# EAGLE design AlarmClock (EAGLE 7.6.0)
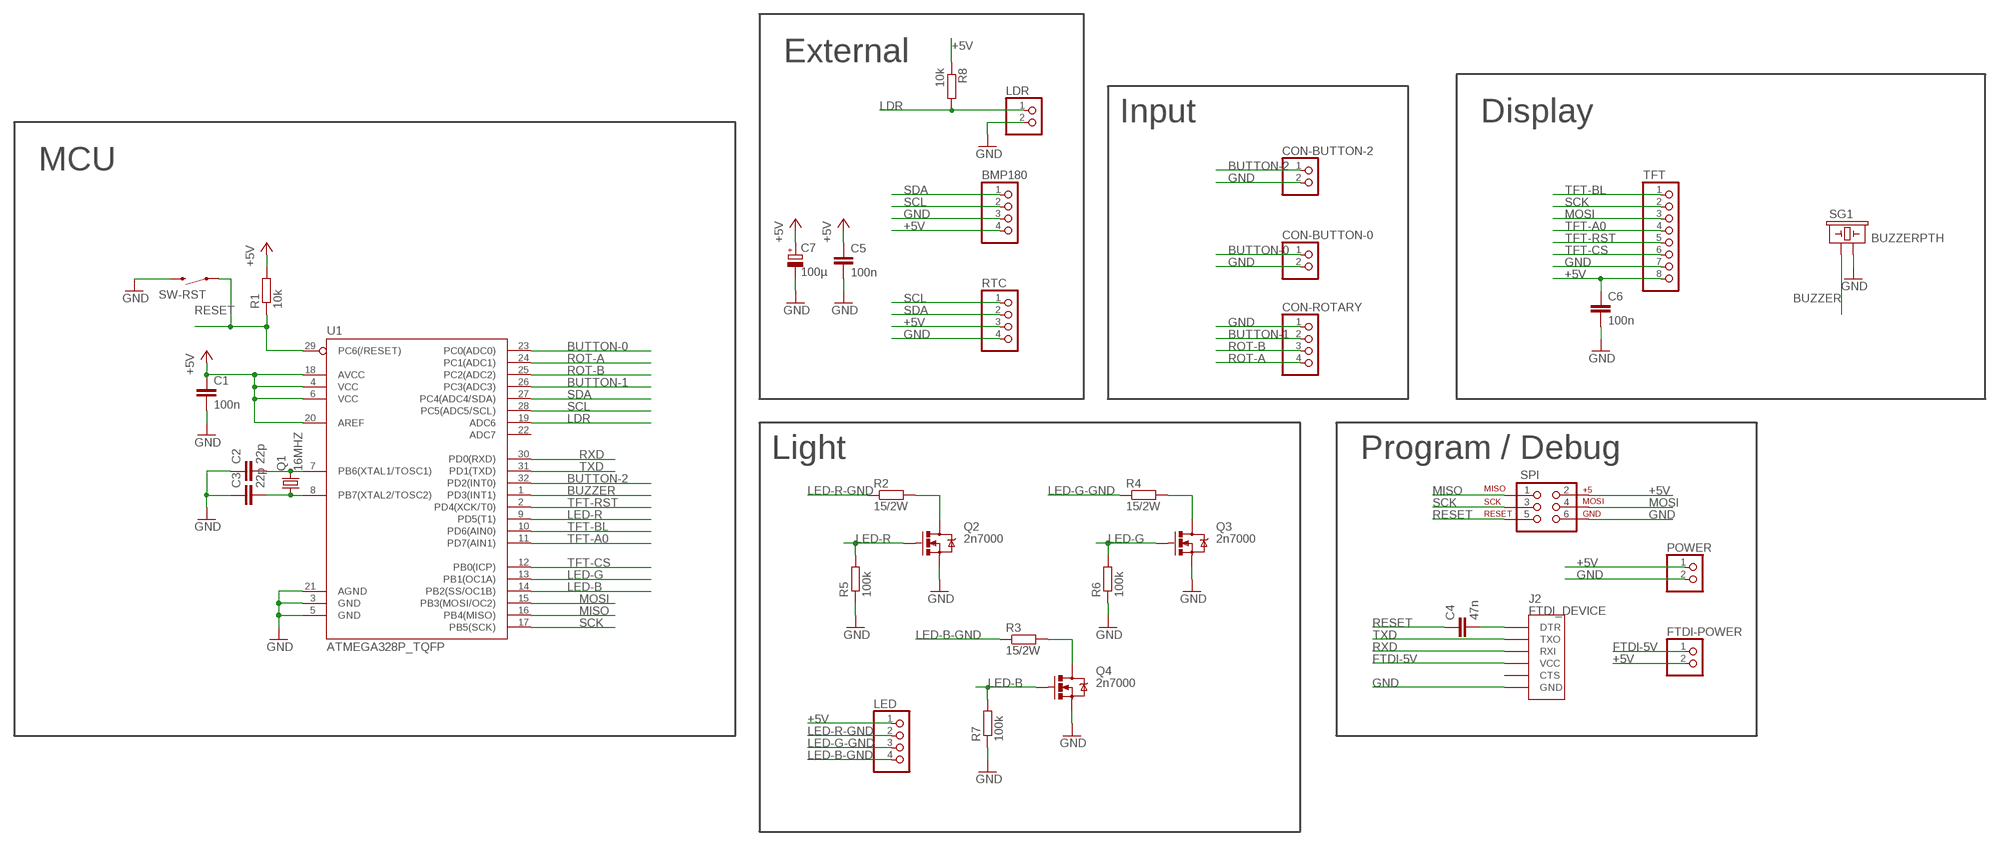
[diagram p0: schematic, sheet 1]

## Parts
BMP180  PINHD-1X4  [1X04]
C1  100n  C-EUC0805  [C0805]
C2  22p  C-EUC0805  [C0805]
C3  22p  C-EUC0805  [C0805]
C4  47n  C-EUC0805  [C0805]
C5  100n  C-EUC0805  [C0805]
C6  100n  C-EUC0805  [C0805]
C7  100µ  CPOL-EUF  [PANASONIC_F]
CON-BUTTON-0  PINHD-1X2/90  [1X02/90]
CON-BUTTON-2  PINHD-1X2/90  [1X02/90]
CON-ROTARY  PINHD-1X4/90  [1X04/90]
FTDI-POWER  PINHD-1X2  [1X02]
J2  FTDI_DEVICE  [FTDI_DEVICE_SIDE]
LDR  PINHD-1X2  [1X02]
LED  PINHD-1X4  [1X04]
POWER  PINHD-1X2  [1X02]
Q1  16MHZ  CRYSTALHC49UP  [HC49UP]
Q2  2n7000  MOSFET-NCHANNEL2N7000  [TO-92]
Q3  2n7000  MOSFET-NCHANNEL2N7000  [TO-92]
Q4  2n7000  MOSFET-NCHANNEL2N7000  [TO-92]
R1  10k  R-EU_M0805  [M0805]
R2  15/2W  R-EU_0414/15  [0414/15]
R3  15/2W  R-EU_0414/15  [0414/15]
R4  15/2W  R-EU_0414/15  [0414/15]
R5  100k  R-EU_M0805  [M0805]
R6  100k  R-EU_M0805  [M0805]
R7  100k  R-EU_M0805  [M0805]
R8  10k  R-EU_R0805  [R0805]
RTC  PINHD-1X4  [1X04]
SG1  BUZZERPTH  [BUZZER-12MM]
SPI  AVR_SPI_PRG_6NS  [2X3-NS]
SW-RST  SWITCH-MOMENTARY-2SMD-1101NE  [TACTILE-SWITCH-1101NE]
TFT  PINHD-1X8  [1X08]
U1  ATMEGA328P_TQFP  [TQFP32-08]

## Nets
+5V: BMP180.4 C1.1 C5.1 C6.1 C7.+ FTDI-POWER.2 LED.1 POWER.1 R1.2 R8.1 RTC.3 SPI.2 TFT.8 U1.4(VCC) U1.6(VCC) U1.18(AVCC) U1.20(AREF)
BUTTON-0: CON-BUTTON-0.1 U1.23(PC0(ADC0))
BUTTON-1: CON-ROTARY.2 U1.26(PC3(ADC3))
BUTTON-2: CON-BUTTON-2.1 U1.32(PD2(INT0))
BUZZER: SG1.+ U1.1(PD3(INT1))
FTDI-5V: FTDI-POWER.1 J2.P$4(VCC)
GND: BMP180.3 C1.2 C2.1 C3.1 C5.2 C6.2 C7.- CON-BUTTON-0.2 CON-BUTTON-2.2 CON-ROTARY.1 J2.P$6(GND) LDR.2 POWER.2 Q2.1(S) Q3.1(S) Q4.1(S) R5.1 R6.1 R7.1 RTC.4 SG1.- SPI.6 SW-RST.2 TFT.7 U1.3(GND) U1.5(GND) U1.21(AGND)
LDR: LDR.1 R8.2 U1.19(ADC6)
LED-B: Q4.2(G) R7.2 U1.14(PB2(SS/OC1B))
LED-B-GND: LED.4 R3.1
LED-G: Q3.2(G) R6.2 U1.13(PB1(OC1A))
LED-G-GND: LED.3 R4.1
LED-R: Q2.2(G) R5.2 U1.9(PD5(T1))
LED-R-GND: LED.2 R2.1
MISO: SPI.1 U1.16(PB4(MISO))
MOSI: SPI.4 TFT.3 U1.15(PB3(MOSI/OC2))
N$1: C4.2 J2.P$1(DTR)
N$2: C2.2 Q1.2 U1.7(PB6(XTAL1/TOSC1))
N$3: C3.2 Q1.1 U1.8(PB7(XTAL2/TOSC2))
N$4: Q2.3(D) R2.2
N$5: Q3.3(D) R4.2
N$6: Q4.3(D) R3.2
RESET: C4.1 R1.1 SPI.5 SW-RST.1 U1.29(PC6(/RESET))
ROT-A: CON-ROTARY.4 U1.24(PC1(ADC1))
ROT-B: CON-ROTARY.3 U1.25(PC2(ADC2))
RXD: J2.P$3(RXI) U1.30(PD0(RXD))
SCK: SPI.3 TFT.2 U1.17(PB5(SCK))
SCL: BMP180.2 RTC.1 U1.28(PC5(ADC5/SCL))
SDA: BMP180.1 RTC.2 U1.27(PC4(ADC4/SDA))
TFT-A0: TFT.4 U1.11(PD7(AIN1))
TFT-BL: TFT.1 U1.10(PD6(AIN0))
TFT-CS: TFT.6 U1.12(PB0(ICP))
TFT-RST: TFT.5 U1.2(PD4(XCK/T0))
TXD: J2.P$2(TXO) U1.31(PD1(TXD))
Unconnected: J2.P$5(CTS) U1.22(ADC7)

## Notes on the sheet
- External
- Input | Display
- MCU
- Light | Program / Debug

## Library data of the parts
BMP180 CON-ROTARY LED RTC = pinhead:PINHD-1X4: PIN HEADER
C1-C6 = resistor:C-EU: CAPACITOR, European symbol
C7 = resistor:CPOL-EU: POLARIZED CAPACITOR, European symbol
CON-BUTTON-0 CON-BUTTON-2 FTDI-POWER LDR POWER = pinhead:PINHD-1X2: PIN HEADER
J2 = SparkFun-Connectors:FTDI_DEVICE: Connector which mates to FTDI basic or FTDI cable.
Q1 = crystal:CRYSTAL: CRYSTAL; OC_FARNELL: unknown; OC_NEWARK: unknown
Q2-Q4 = SparkFun-DiscreteSemi:MOSFET-NCHANNEL: Common NMOSFET Parts MFG P/N Store ID Prod ID FDD8780 TRANS-09984 SI7820DN TRANS-11055 FDS6630A IC-08089 2N7002PW TRANS-11151 FQP30N06L COM-10213 TRANS-10060 BSS123LT1G TRANS-08345 BSS138 TRANS-00830 BS170 2N7000
R1-R8 = resistor:R-EU_: RESISTOR, European symbol
SG1 = SparkFun-Electromechanical:BUZZER: Buzzer 12mm Spark Fun Electronics SKU : Comp-Buzzer
SPI = SparkFun-Connectors:AVR_SPI_PRG_6: AVR ISP 6 Pin This is the reduced ISP connector for AVR programming. Common on Arduino. This footprint will take up less PCB space and can be used with a 10-pin to 6-pin adapter such as SKU: BOB-08508 **Special note about "TEST_POINT" package. The stop mask is on the top side, so if you want your programming test points to be on the bottom of your board, make sure to place this package on the bottom side of the board. This also ensure that the orientation to program from the bottom side will be correct.
SW-RST = SparkFun-Electromechanical:SWITCH-MOMENTARY-2: Various NO switches- pushbuttons, reed, etc; PROD_ID: SWCH-00815
TFT = pinhead:PINHD-1X8: PIN HEADER
U1 = SparkFun-DigitalIC:ATMEGA328P_TQFP; PROD_ID: IC-09069

## Board
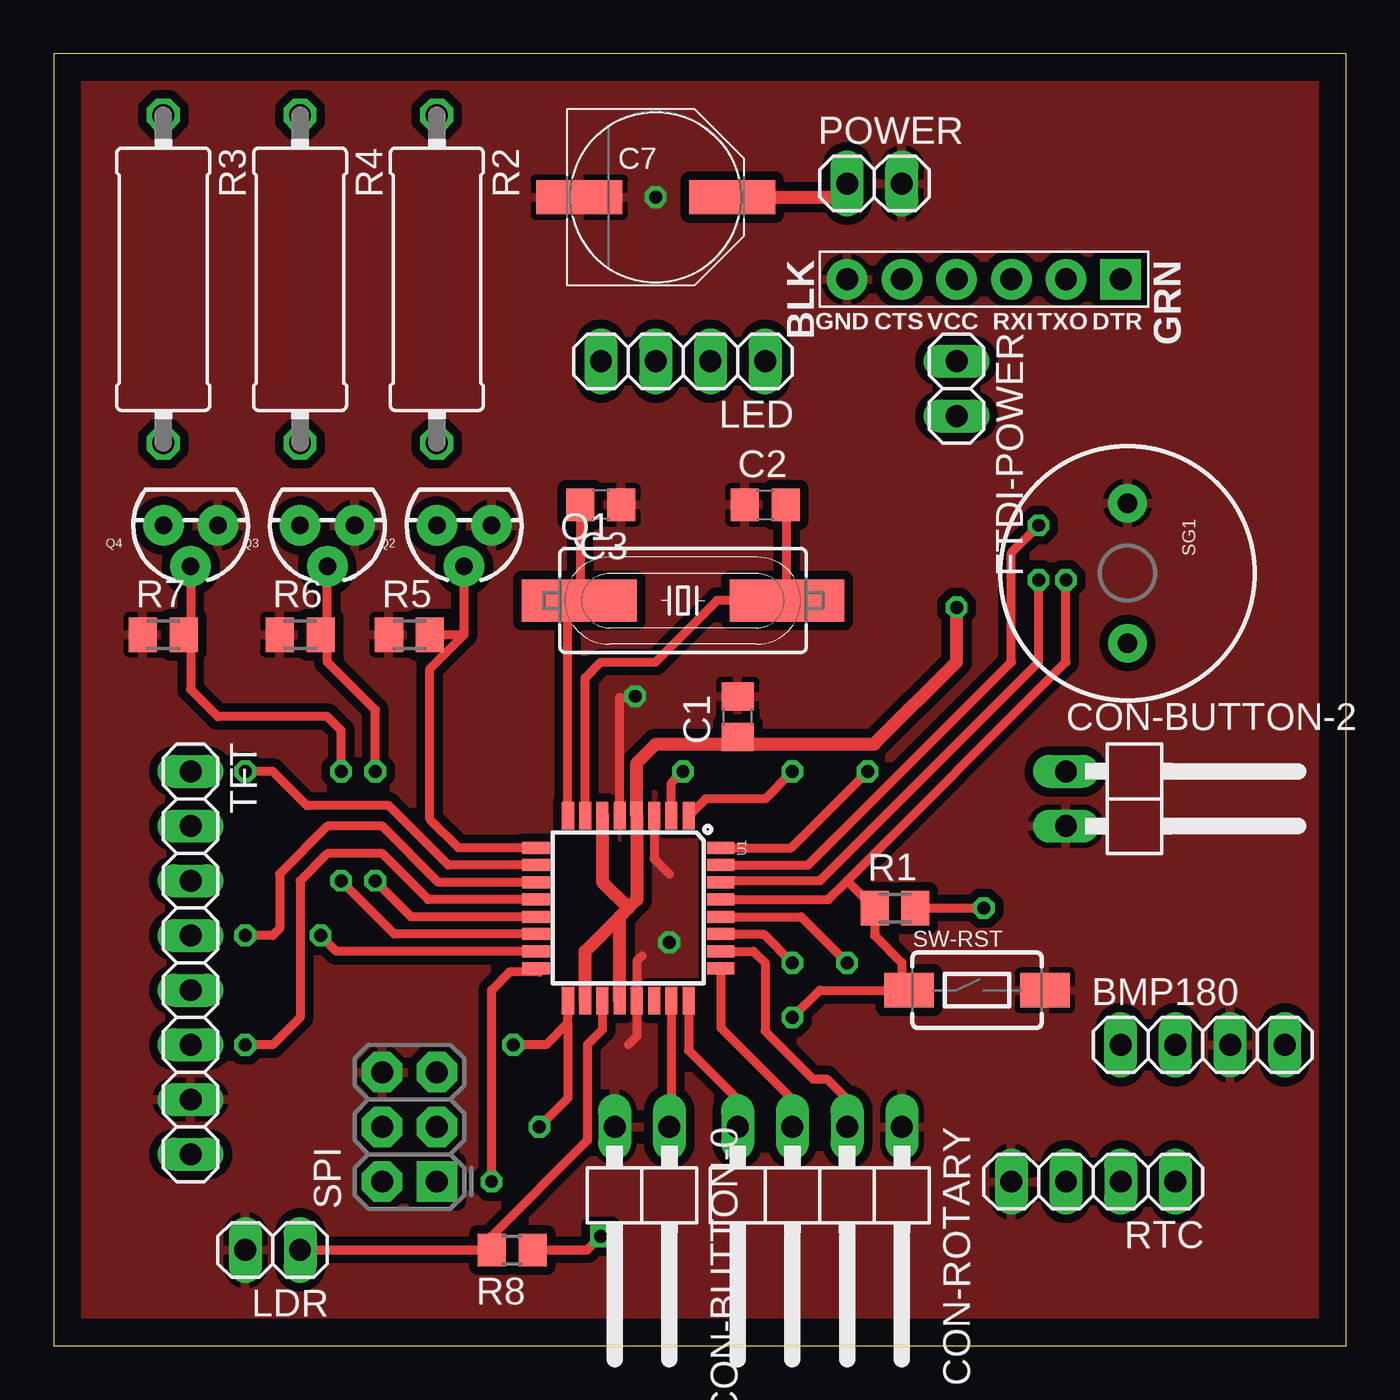
[diagram p1: board, top side]
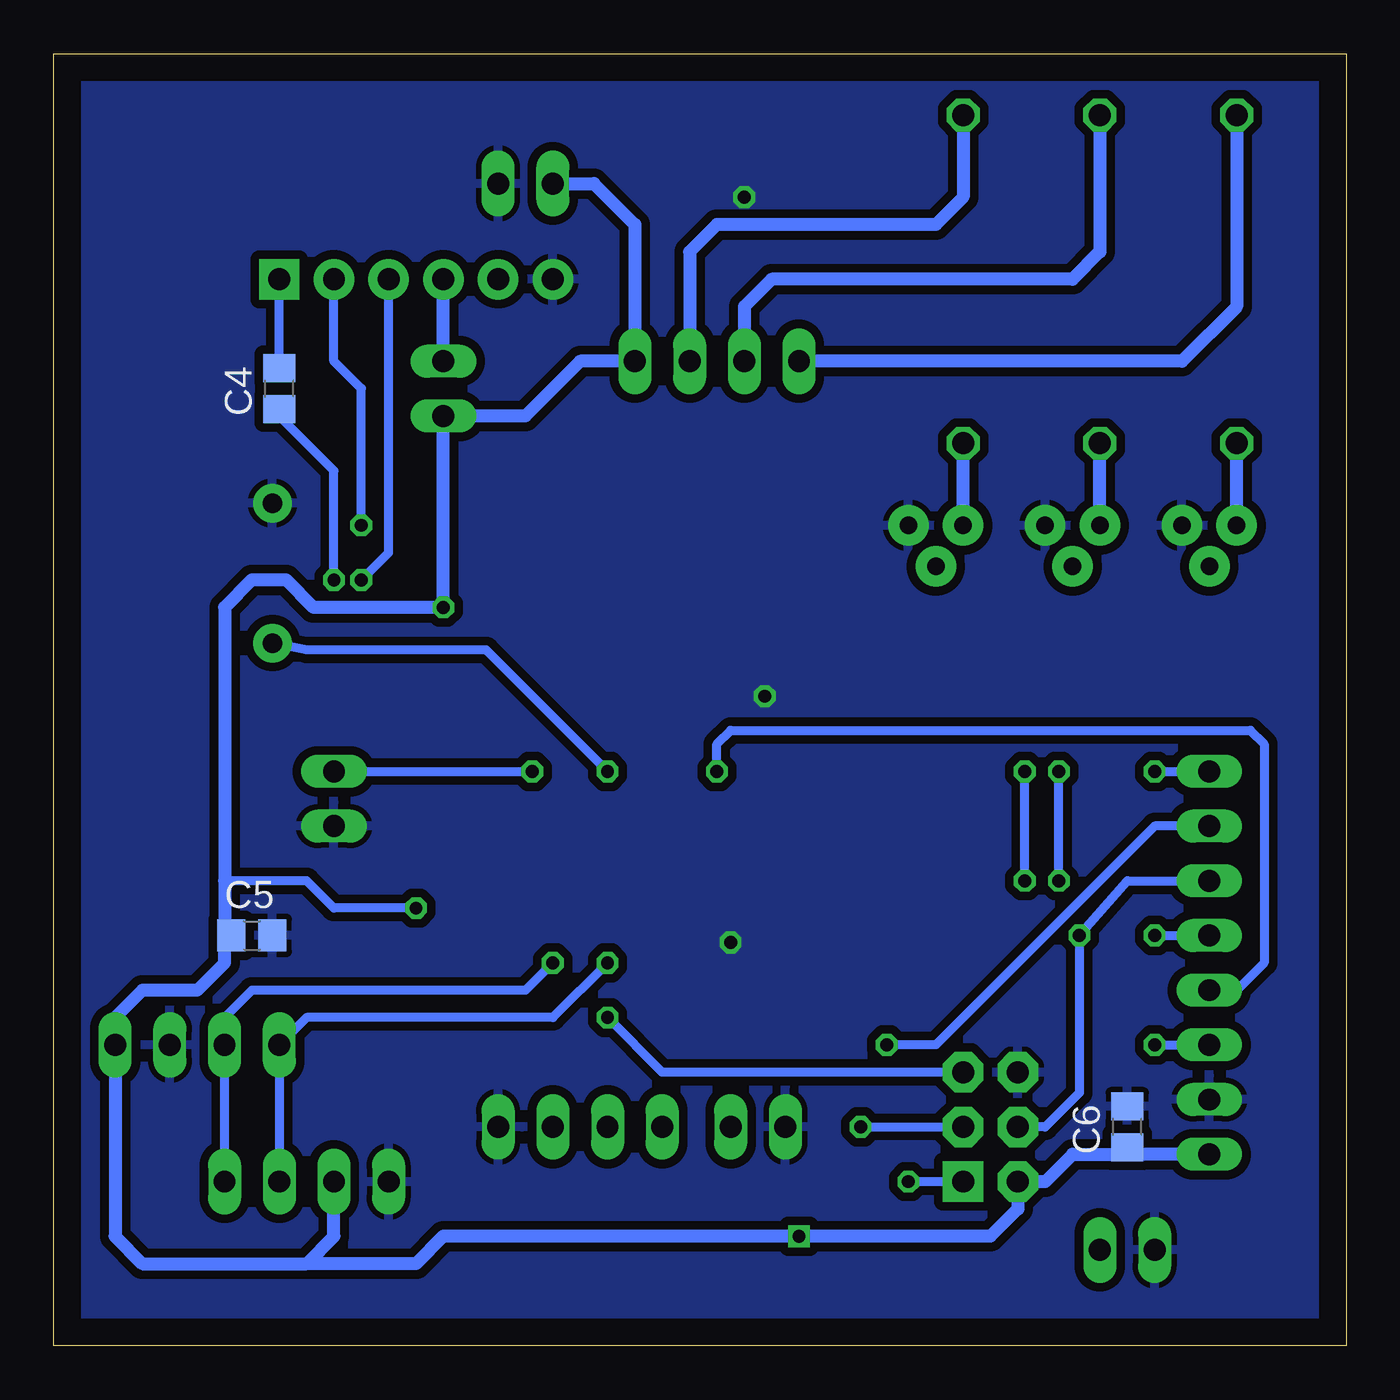
[diagram p2: board, bottom side, seen from below]

Size 59.99 x 60 mm. Coordinates in mm from the lower left corner, seen from the top.
Outline: 0,0 59.99,0 59.99,60 0,60 0,0
Copper layers (1*16): Top 0.035mm / dielectric 1.5mm / Bottom 0.035mm
Design rules "default *": minimum track width 10mil, minimum drill 0.6mm, track to track 8mil, track to pad 8mil, pad to pad 8mil, via to via 8mil, smd to smd 8mil, copper to edge 50mil, drill to drill 8mil, minimum pad ring 10mil, minimum via ring 8mil, stop-mask expansion 4mil, vias tented up to drill 0mil, thermal gap 10mil

### Footprints (pad centres in the part's own frame; a part is rotated, then mirrored left to right if it is on the bottom)
1X04 = drill 1.016 long: 1 -3.81,0; 2 -1.27,0; 3 1.27,0; 4 3.81,0
C0805 = smd 1.3 x 1.5: 1 -0.95,0; 2 0.95,0
PANASONIC_F = smd 4 x 1.6: + 3.55,0; - -3.55,0
1X02/90 = drill 1.016 long: 1 -1.27,-3.81; 2 1.27,-3.81
1X04/90 = drill 1.016 long: 1 -3.81,-3.81; 2 -1.27,-3.81; 3 1.27,-3.81; 4 3.81,-3.81
1X02 = drill 1.016 long: 1 -1.27,0; 2 1.27,0
FTDI_DEVICE_SIDE = drill 1.016 pad 1.88 square: P$1 -6.35,0 | drill 1.016 pad 1.88: P$2 -3.81,0; P$3 -1.27,0; P$4 1.27,0; P$5 3.81,0; P$6 6.35,0
HC49UP = smd 5.334 x 1.93: 1 -4.826,0; 2 4.826,0
TO-92 = drill 0.813 pad 1.88: 1 -1.27,0; 2 0,1.905; 3 1.27,0
M0805 = smd 1.3 x 1.6: 1 -0.95,0; 2 0.95,0
0414/15 = drill 1.016 octagon: 1 -7.62,0; 2 7.62,0
R0805 = smd 1.3 x 1.5: 1 -0.95,0; 2 0.95,0
BUZZER-12MM = drill 0.9 pad 1.778: + 3.25,0; - -3.25,0
2X3-NS = drill 1.016 pad 1.88 square: 1 -2.54,-1.27 | drill 1.016 pad 1.88 octagon: 2 -2.54,1.27; 3 0,-1.27; 4 0,1.27; 5 2.54,-1.27; 6 2.54,1.27
TACTILE-SWITCH-1101NE = smd 2.3 x 1.6: 1 -3.15,0; 2 3.15,0
1X08 = drill 1.016 long: 1 -8.89,0; 2 -6.35,0; 3 -3.81,0; 4 -1.27,0; 5 1.27,0; 6 3.81,0; 7 6.35,0; 8 8.89,0
TQFP32-08 = smd 1.27 x 0.559: 1 -4.293,2.8; 2 -4.293,2; 3 -4.293,1.2; 4 -4.293,0.4; 5 -4.293,-0.4; 6 -4.293,-1.2; 7 -4.293,-2; 8 -4.293,-2.8; 17 4.293,-2.8; 18 4.293,-2; 19 4.293,-1.2; 20 4.293,-0.4; 21 4.293,0.4; 22 4.293,1.2; 23 4.293,2; 24 4.293,2.8 | smd 0.559 x 1.27: 9 -2.8,-4.293; 10 -2,-4.293; 11 -1.2,-4.293; 12 -0.4,-4.293; 13 0.4,-4.293; 14 1.2,-4.293; 15 2,-4.293; 16 2.8,-4.293; 25 2.8,4.293; 26 2,4.293; 27 1.2,4.293; 28 0.4,4.293; 29 -0.4,4.293; 30 -1.2,4.293; 31 -2,4.293; 32 -2.8,4.293

### Placement (x,y rotation side)
BMP180  53.34,13.97 0 top
C1  31.75,29.21 90 top
C2  33.02,39.05 0 top
C3  25.4,39.05 180 top
C4  49.53,44.45 90 bottom
C5  50.8,19.05 0 bottom
C6  10.16,10.16 90 bottom
C7  27.94,53.34 0 top
CON-BUTTON-0  27.3,6.35 180 top
CON-BUTTON-2  50.8,25.4 270 top
CON-ROTARY  35.56,6.35 180 top
FTDI-POWER  41.91,44.45 270 top
J2  43.18,49.53 180 top
LDR  10.16,4.45 180 top
LED  29.21,45.72 180 top
POWER  38.1,53.98 0 top
Q1  29.21,34.61 0 top
Q2  19.05,38.1 180 top
Q3  12.7,38.1 180 top
Q4  6.35,38.1 180 top
R1  39.05,20.32 0 top
R2  17.78,49.53 270 top
R3  5.08,49.53 270 top
R4  11.43,49.53 270 top
R5  16.51,33.02 0 top
R6  11.43,33.02 0 top
R7  5.08,33.02 0 top
R8  21.27,4.45 180 top
RTC  48.26,7.62 180 top
SG1  49.85,35.88 270 top
SPI  16.51,10.16 90 top
SW-RST  42.86,16.51 0 top
TFT  6.35,17.78 270 top
U1  26.67,20.32 270 top

### Tracks (layer width: path | path; a pad name or v marks a point on that pad's centre or on a via)
+5V  (via drill 0.6)
  Top 0.406: R1.2 v43.18,20.32 | R8.1 24.77,4.45 v25.4,5.08
  Top 0.61: U1.20 26.27,19.92 | 26.67,20.32 27.07,20.72 U1.4 27.07,27.07 27.94,27.94 31.43,27.94 C1.1 32.07,27.94 38.1,27.94 41.91,31.75 v41.91,34.29 | 26.67,20.32 26.27,19.92 | U1.18 24.67,18.32 26.27,19.92 | U1.6 25.47,21.52 26.67,20.32 | C7.+ 36.2,53.34 POWER.1
  Bottom 0.406: v43.18,20.32 46.99,20.32 48.26,21.59 52.07,21.59
  Bottom 0.61: 52.07,18.73 52.07,21.59 52.07,34.29 50.8,35.56 49.21,35.56 47.94,34.29 v41.91,34.29 FTDI-POWER.2 38.1,43.18 35.56,45.72 LED.1 33.02,52.07 34.92,53.98 POWER.1 | 48.26,3.81 55.88,3.81 57.15,5.08 BMP180.4 57.15,15.24 55.88,16.51 53.34,16.51 52.07,17.78 52.07,18.73 | 48.26,3.81 46.99,5.08 RTC.3 | 52.07,18.73 C5.1 | 10.48,8.89 12.7,8.89 13.97,7.62 SPI.2 15.24,6.35 16.51,5.08 v25.4,5.08 41.91,5.08 43.18,3.81 48.26,3.81 | 10.48,8.89 C6.1 9.84,8.89 TFT.8 10.48,8.89
BUTTON-0
  Top 0.406: U1.23 28.67,10.26 CON-BUTTON-0.1
BUTTON-1
  Top 0.406: U1.26 32.48,18.32 33.02,17.78 33.02,14.61 35.24,12.38 35.88,12.38 36.83,11.43 CON-ROTARY.2
BUTTON-2  (via drill 0.6)
  Top 0.406: v37.78,26.67 34.23,23.12 U1.32
  Bottom 0.406: CON-BUTTON-2.1 v37.78,26.67
BUZZER  (via drill 0.6)
  Top 0.406: v34.29,26.67 33.02,25.4 30.26,25.4 U1.1
  Bottom 0.406: v34.29,26.67 39.93,32.31 48.26,32.31 SG1.+
FTDI-5V
  Bottom 0.61: FTDI-POWER.1 J2.P$4
GND  (via drill 0.6)
  Top 0.406: 27.3,18.1 27.07,17.86 U1.21 27.07,14.37 26.67,13.97 | 26.27,25.8 U1.5 26.27,30.08 v26.99,30.16 | U1.3 27.87,22.61 28.57,21.91
  other vias: 28.57,18.73 27.94,53.34
  pour Bottom (isolate 0.406): 59.69,59.69 0,59.69 0,0 59.69,0
  pour Top (isolate 0.406): 59.69,59.69 0,59.69 0,0 59.69,0
LDR
  Top 0.406: U1.19 25.47,14.68 24.77,13.97 24.77,9.53 20.32,5.08 20.32,4.76 R8.2 LDR.1
LED-B  (via drill 0.6)
  Top 0.406: U1.14 15.8,19.12 v13.34,21.59 | Q4.2 6.35,33.02 | 6.35,33.02 6.35,30.48 7.62,29.21 12.7,29.21 13.34,28.57 v13.34,26.67 | R7.2 6.35,33.02
  Bottom 0.406: v13.34,21.59 v13.34,26.67
LED-B-GND
  Bottom 0.61: R3.1 5.08,48.26 7.62,45.72 LED.4
LED-G  (via drill 0.6)
  Top 0.406: U1.13 16.59,19.92 v14.92,21.59 | v14.92,26.67 14.92,29.53 12.7,31.75 12.7,33.02 | 12.7,33.02 Q3.2 | R6.2 12.7,33.02
  Bottom 0.406: v14.92,21.59 v14.92,26.67
LED-G-GND
  Bottom 0.61: R4.1 11.43,50.8 12.7,49.53 26.67,49.53 27.94,48.26 LED.3
LED-R
  Top 0.406: U1.9 18.79,23.12 17.46,24.45 17.46,31.43 19.05,33.02 | 19.05,33.02 Q2.2 | R5.2 19.05,33.02
LED-R-GND
  Bottom 0.61: R2.1 17.78,53.34 19.05,52.07 29.21,52.07 30.48,50.8 LED.2
MISO  (via drill 0.6)
  Top 0.406: U1.16 22.54,17.36 21.16,17.36 20.32,16.51 v20.32,7.62
  Bottom 0.406: SPI.1 v20.32,7.62
MOSI  (via drill 0.6)
  Top 0.406: U1.15 13.11,18.32 v12.38,19.05
  Bottom 0.406: TFT.3 10.16,21.59 v12.38,19.05 12.38,11.75 13.97,10.16 SPI.4
N$1
  Bottom 0.406: C4.2 J2.P$1
N$2
  Top 0.406: U1.7 24.67,31.02 25.4,31.75 27.94,31.75 30.8,34.61 Q1.2 34.04,38.99 C2.2
N$3
  Top 0.406: C3.2 24.45,34.67 Q1.1 23.87,34.09 U1.8
N$4
  Bottom 0.61: Q2.3 R2.2
N$5
  Bottom 0.61: Q3.3 R4.2
N$6
  Bottom 0.61: Q4.3 R3.2
RESET  (via drill 0.6)
  Top 0.406: 39.69,16.53 SW-RST.1 | v34.29,15.24 35.56,16.51 SW-RST.1 | SW-RST.1 39.37,16.85 39.37,17.78 38.1,19.05 R1.1 36.83,21.59 | U1.29 35.96,20.72 36.83,21.59 | 36.83,21.59 46.99,31.75 v46.99,35.56
  Bottom 0.406: SPI.5 31.75,12.7 v34.29,15.24 | v46.99,35.56 46.99,40.64 49.53,43.18 C4.1
ROT-A
  Top 0.406: U1.24 29.47,13.71 31.75,11.43 CON-ROTARY.4
ROT-B
  Top 0.406: U1.25 30.96,14.76 34.29,11.43 CON-ROTARY.3
RXD  (via drill 0.6)
  Top 0.406: U1.30 31.03,21.59 35.56,21.59 45.72,31.75 v45.72,35.56
  Bottom 0.406: v45.72,35.56 44.45,36.83 J2.P$3
SCK  (via drill 0.6)
  Top 0.406: 23.87,14.98 22.86,13.97 v21.33,13.97 | v22.54,10.16 23.87,11.49 23.87,14.98 | U1.17 23.87,15.24 23.87,14.98
  Bottom 0.406: TFT.2 8.89,24.13 19.05,13.97 v21.33,13.97 | v22.54,10.16 SPI.3
SCL  (via drill 0.6)
  Top 0.406: U1.28 34.69,19.92 v36.83,17.78
  Bottom 0.406: v36.83,17.78 38.1,16.51 50.8,16.51 52.07,15.24 BMP180.2 RTC.1
SDA  (via drill 0.6)
  Top 0.406: U1.27 32.95,19.12 v34.29,17.78
  Bottom 0.406: v34.29,17.78 36.83,15.24 48.26,15.24 BMP180.1 RTC.2
TFT-A0  (via drill 0.6)
  Top 0.406: U1.11 17.85,21.52 15.24,24.13 12.7,24.13 10.48,21.91 10.48,19.37 10.16,19.05 v8.89,19.05
  Bottom 0.406: v8.89,19.05 TFT.4
TFT-BL  (via drill 0.6)
  Top 0.406: U1.10 18.32,22.32 15.56,25.08 11.75,25.08 10.16,26.67 v8.89,26.67
  Bottom 0.406: v8.89,26.67 TFT.1
TFT-CS  (via drill 0.6)
  Top 0.406: U1.12 17.38,20.72 15.24,22.86 12.7,22.86 11.43,21.59 11.43,15.24 10.16,13.97 v8.89,13.97
  Bottom 0.406: v8.89,13.97 TFT.6
TFT-RST  (via drill 0.6)
  Top 0.406: U1.2 28.67,26.13 v29.21,26.67
  Bottom 0.406: v29.21,26.67 29.21,27.94 28.57,28.57 4.45,28.57 3.81,27.94 3.81,17.78 5.08,16.51 TFT.5
TXD  (via drill 0.6)
  Top 0.406: U1.31 35.02,22.32 44.45,31.75 44.45,36.83 v45.72,38.1
  Bottom 0.406: v45.72,38.1 45.72,44.45 46.99,45.72 J2.P$2